# Altium project audio_dev_pcb.PrjPcb (part 3 of 3)

## Sheet audio_io.SchDoc
size A3; SheetNumber: 13; SheetTotal: 13
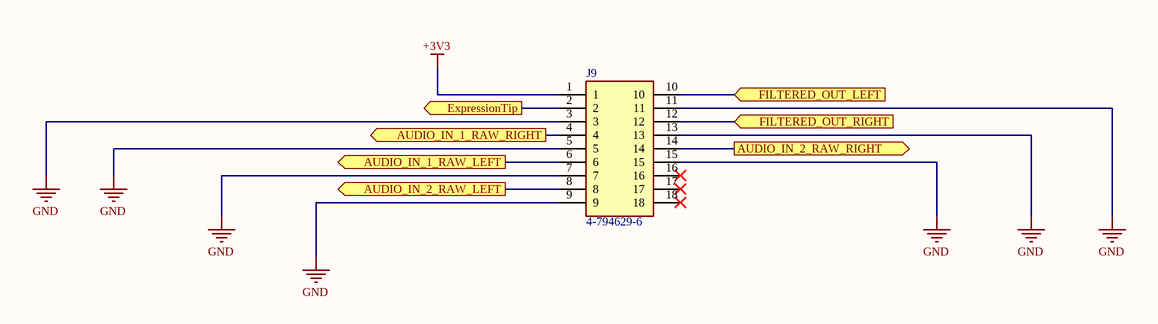
[diagram p11: audio_io.SchDoc]

### Parts
J9  4-794629-6  [47946296]

### Ports
AUDIO_IN_1_RAW_LEFT (out, see high_level[7B], Input_Output_Filtering[3B]), AUDIO_IN_1_RAW_RIGHT (out, see high_level[7B], Input_Output_Filtering[3C]), AUDIO_IN_2_RAW_LEFT (out, see high_level[7C], Input_Output_Filtering[3A]), AUDIO_IN_2_RAW_RIGHT (out, see high_level[7B], Input_Output_Filtering[3B]), ExpressionTip (out, see high_level[7B], Expression_Pedal[3B]), FILTERED_OUT_LEFT (in, see high_level[7C], Input_Output_Filtering[6D]), FILTERED_OUT_RIGHT (in, see high_level[7C], Input_Output_Filtering[6D])

### Nets
+3V3: J9.1
GND: J9.3 J9.5 J9.7 J9.9 J9.11 J9.13 J9.15
AUDIO_IN_1_RAW_LEFT: J9.6 ; port AUDIO_IN_1_RAW_LEFT
AUDIO_IN_1_RAW_RIGHT: J9.4 ; port AUDIO_IN_1_RAW_RIGHT
AUDIO_IN_2_RAW_LEFT: J9.8 ; port AUDIO_IN_2_RAW_LEFT
AUDIO_IN_2_RAW_RIGHT: J9.14 ; port AUDIO_IN_2_RAW_RIGHT
ExpressionTip: J9.2 ; port ExpressionTip
FILTERED_OUT_LEFT: J9.10 ; port FILTERED_OUT_LEFT
FILTERED_OUT_RIGHT: J9.12 ; port FILTERED_OUT_RIGHT

Not connected (* = marked no-connect by the designer): J9 16* 17* 18*

### Library data of the parts
J9 = 4-794629-6: Connector; Manufacturer_Name: TE Connectivity; Datasheet Link: https://www.te.com/commerce/DocumentDelivery/DDEController?Action=srchrtrv&DocNm=micro-mate-n-lok-connector-qrg&DocType=Data%20Sheet&DocLang=English&PartCntxt=4-794629-6&DocFormat=pdf; Height: 8.67mm; Manufacturer_Part_Number: 4-794629-6; Mouser Part Number: 571-4-794629-6; Mouser Price/Stock: https://www.mouser.co.uk/ProductDetail/TE-Connectivity-AMP/4-794629-6?qs=vczR1Rbrl535QN5OwRvF4g%3D%3D; Arrow Part Number: 4-794629-6; Arrow Price/Stock: https://www.arrow.com/en/products/4-794629-6/te-connectivity?region=nac

## Sheet Footswitches.SchDoc
size A3; SheetNumber: 12; SheetTotal: 13
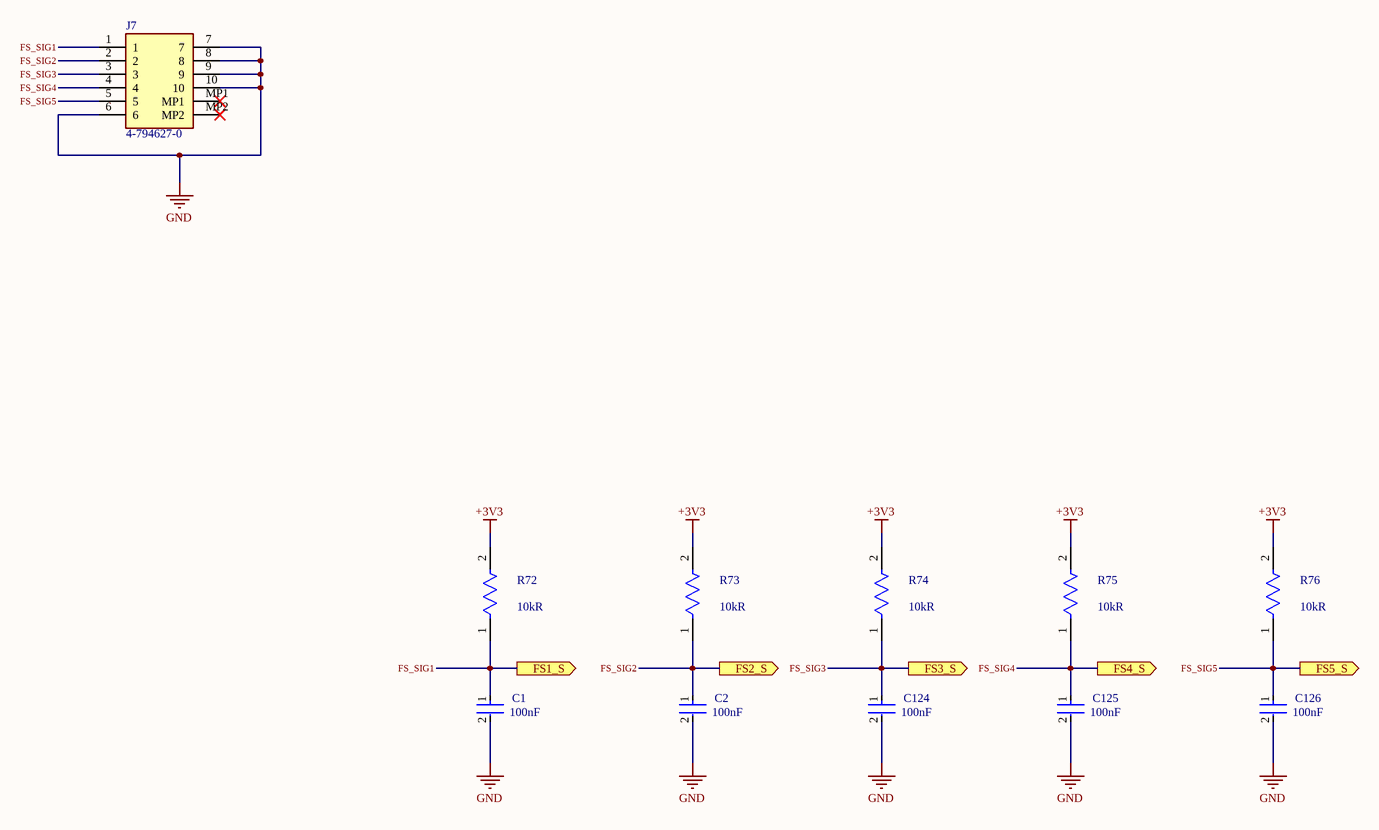
[diagram p12: Footswitches.SchDoc]

### Parts
C1  Capacitance: 100nF  [FP-GCM155-0_05-IPC_A]  (hidden comment: GCM155R71H104ME02J)
C2  Capacitance: 100nF  [FP-GCM155-0_05-IPC_A]  (hidden comment: GCM155R71H104ME02J)
C124  Capacitance: 100nF  [FP-GCM155-0_05-IPC_A]  (hidden comment: GCM155R71H104ME02J)
C125  Capacitance: 100nF  [FP-GCM155-0_05-IPC_A]  (hidden comment: GCM155R71H104ME02J)
C126  Capacitance: 100nF  [FP-GCM155-0_05-IPC_A]  (hidden comment: GCM155R71H104ME02J)
J7  4-794627-0  [47946270]
R72  Resistance: 10kR  [FP-RC0402-0_4-IPC_A]  (hidden comment: RC0402FR-1310KL)
R73  Resistance: 10kR  [FP-RC0402-0_4-IPC_A]  (hidden comment: RC0402FR-1310KL)
R74  Resistance: 10kR  [FP-RC0402-0_4-IPC_A]  (hidden comment: RC0402FR-1310KL)
R75  Resistance: 10kR  [FP-RC0402-0_4-IPC_A]  (hidden comment: RC0402FR-1310KL)
R76  Resistance: 10kR  [FP-RC0402-0_4-IPC_A]  (hidden comment: RC0402FR-1310KL)

### Ports
FS1_S (out, see high_level[3B], MCU_Connections[7C]), FS2_S (out, see high_level[3B], MCU_Connections[7C]), FS3_S (out, see high_level[3B], MCU_Connections[7C]), FS4_S (out, see high_level[3B], MCU_Connections[7C]), FS5_S (out, see high_level[3B], MCU_Connections[7C])

### Nets
+3V3: R72.2 R73.2 R74.2 R75.2 R76.2
GND: C1.2 C2.2 C124.2 C125.2 C126.2 J7.6 J7.7 J7.8 J7.9 J7.10
FS_SIG1: C1.1 J7.1 R72.1 ; port FS1_S
FS_SIG2: C2.1 J7.2 R73.1 ; port FS2_S
FS_SIG3: C124.1 J7.3 R74.1 ; port FS3_S
FS_SIG4: C125.1 J7.4 R75.1 ; port FS4_S
FS_SIG5: C126.1 J7.5 R76.1 ; port FS5_S

Not connected (* = marked no-connect by the designer): J7 MP1* MP2*

### Library data of the parts
C1 C2 C124-C126 = CMP-06035-028957-1: as C108-C123 on sheet Potentiometers
J7 = 4-794627-0: Connector; Manufacturer_Name: TE Connectivity; Datasheet Link: https://www.te.com/commerce/DocumentDelivery/DDEController?Action=srchrtrv&DocNm=micro-mate-n-lok-connector-qrg&DocType=Data%20Sheet&DocLang=English&PartCntxt=4-794627-0&DocFormat=pdf; Height: 8.67mm; Manufacturer_Part_Number: 4-794627-0; Mouser Part Number: 571-4-794627-0; Mouser Price/Stock: https://www.mouser.co.uk/ProductDetail/TE-Connectivity-AMP/4-794627-0?qs=%252BzEhGsOvNvVYq3FriCmQcA%3D%3D; Arrow Part Number: 4-794627-0; Arrow Price/Stock: https://www.arrow.com/en/products/4-794627-0/te-connectivity
R72-R76 = CMP-2002-07854-2: RESISTOR 0402 10K 1%; Power Rating: 62.5mW; Voltage Rating (DC): 50V; Temperature Coefficient: 100ppm/°C; REACH SVHC: No SVHC; Case/Package: 0402; Termination: SMD/SMT; Max Operating Temperature: 155°C; Contact Plating: Tin; Resistance Tolerance: 1%; Radiation Hardening: No; Voltage Rating: 50V; Lead Free: Lead Free; Length: 1mm; Depth: 0.5mm; Number of Pins: 2; RoHS Compliant: Yes; Case Code (Imperial): 0402; Case Code (Metric): 1005; Min Operating Temperature: -55°C; Packaging: Tape and Reel; Technology: THICK FILM; Series: RC; Number of Terminations: 2; Resistor Type: Thick Film; Tolerance: 1%; Working Voltage: 50V; Military Standard: Not; Construction: Rectangular

## Nets that join several sheets
+1V8: Power (C70.2 R49.2 U4.5), USB_HS (C23.2 IC1.21)
+3V3: Memory (28 pins), Power (5 pins), USB_HS (8 pins), Peripherals (13 pins), MCU (34 pins), audio_io (J9.1), Footswitches (5 pins)
+5VA: Expression_Pedal (C106.1 IC12.5), Input_Output_Filtering (13 pins), Power (5 pins), Potentiometers (16 pins)
+VUSB_FILT: Power (D1.2), USB_HS (C78.1 R3.1), Peripherals (C83.2 FB3.2)
GND: Codec (15 pins), Expression_Pedal (C106.2 C107.2 IC12.2 R61.1), Input_Output_Filtering (36 pins), Memory (28 pins), Power (24 pins), USB_HS (9 pins), Peripherals (25 pins), Potentiometers (24 pins), MCU (44 pins), audio_io (7 pins), Footswitches (10 pins)
AUDIO_IN_1_FILTERED_LEFT: Codec (IC3.10), Input_Output_Filtering (C37.2)
AUDIO_IN_1_FILTERED_RIGHT: Codec (IC3.12), Input_Output_Filtering (C42.2)
AUDIO_IN_1_RAW_LEFT: Input_Output_Filtering (R17.1 RV3.2), audio_io (J9.6)
AUDIO_IN_1_RAW_RIGHT: Input_Output_Filtering (R21.1 RV4.2), audio_io (J9.4)
AUDIO_IN_2_FILTERED_LEFT: Codec (IC3.14), Input_Output_Filtering (C60.2)
AUDIO_IN_2_FILTERED_RIGHT: Codec (IC3.16), Input_Output_Filtering (C65.2)
AUDIO_IN_2_RAW_LEFT: Input_Output_Filtering (R39.1 RV1.2), audio_io (J9.8)
AUDIO_IN_2_RAW_RIGHT: Input_Output_Filtering (R43.1 RV2.2), audio_io (J9.14)
CODEC_MCLK: Codec (IC3.1), MCU_Connections (NT11.1)
CODEC_OUT_LEFT: Codec (C55.1), Input_Output_Filtering (C47.1)
CODEC_OUT_RIGHT: Codec (C54.1), Input_Output_Filtering (C51.1)
CODEC_RST: Codec (IC3.31), MCU_Connections (NT23.1)
Expression_Out: Expression_Pedal (R60.2), MCU_Connections (NT14.1)
ExpressionTip: Expression_Pedal (R59.2), audio_io (J9.2)
FILTERED_OUT_LEFT: Input_Output_Filtering (C48.2 R29.2 RV5.2), audio_io (J9.10)
FILTERED_OUT_RIGHT: Input_Output_Filtering (C52.2 R33.2 RV6.2), audio_io (J9.12)
FMC_SDCLK: Memory (IC11.F2), MCU_Connections (R69.1)
FS_SIG1: MCU_Connections (NT61.1), Footswitches (C1.1 J7.1 R72.1)
FS_SIG2: MCU_Connections (NT64.1), Footswitches (C2.1 J7.2 R73.1)
FS_SIG3: MCU_Connections (NT66.1), Footswitches (C124.1 J7.3 R74.1)
FS_SIG4: MCU_Connections (NT67.1), Footswitches (C125.1 J7.4 R75.1)
FS_SIG5: MCU_Connections (NT69.1), Footswitches (C126.1 J7.5 R76.1)
NetIC1_8: USB_HS (IC1.8), MCU_Connections (NT35.1)
NetIC1_9: USB_HS (IC1.9), MCU_Connections (NT32.1)
NetIC1_10: USB_HS (IC1.10), MCU_Connections (NT29.1)
NetIC1_11: USB_HS (IC1.11), MCU_Connections (NT27.1)
NetIC1_12: USB_HS (IC1.12), MCU_Connections (NT37.1)
NetIC1_13: USB_HS (IC1.13), MCU_Connections (NT24.1)
NetIC1_14: USB_HS (IC1.14), MCU_Connections (NT21.1)
NetIC1_15: USB_HS (IC1.15), MCU_Connections (NT18.1)
NetIC1_16: USB_HS (IC1.16), MCU_Connections (NT15.1)
NetIC1_18: USB_HS (IC1.18), MCU_Connections (NT49.1)
NetIC1_19: USB_HS (IC1.19), MCU_Connections (NT42.1)
NetIC1_20: USB_HS (IC1.20), MCU_Connections (NT45.1)
NetIC3_8: Codec (IC3.8 R14.1), MCU_Connections (NT2.1)
NetIC3_9: Codec (IC3.9 R15.1), MCU_Connections (NT5.1)
NetIC10_2: Memory (IC10.2), MCU_Connections (NT4.1)
NetIC21_1: Peripherals (IC21.1), MCU_Connections (NT73.1)
NetIC21_2: Peripherals (IC21.2 IC21.3), MCU_Connections (NT77.1)
NetIC21_4: Peripherals (IC21.4), MCU_Connections (NT75.1)
Pot1_Filtered: Potentiometers (C110.1 R62.2), MCU_Connections (NT39.1)
Pot1_Wiper: Peripherals (J6.2), Potentiometers (IC13.3)
Pot2_Filtered: Potentiometers (C114.1 R64.2), MCU_Connections (NT41.1)
Pot2_Wiper: Peripherals (J6.5), Potentiometers (IC15.3)
Pot3_Filtered: Potentiometers (C118.1 R66.2), MCU_Connections (NT44.1)
Pot3_Wiper: Peripherals (J6.8), Potentiometers (IC17.3)
Pot4_Filtered: Potentiometers (C111.1 R63.2), MCU_Connections (NT48.1)
Pot4_Wiper: Peripherals (J6.11), Potentiometers (IC14.3)
Pot5_Filtered: Potentiometers (C115.1 R65.2), MCU_Connections (NT51.1)
Pot5_Wiper: Peripherals (J6.14), Potentiometers (IC16.3)
Pot6_Filtered: Potentiometers (C119.1 R67.2), MCU_Connections (NT52.1)
Pot6_Wiper: Peripherals (J6.17), Potentiometers (IC18.3)
Pot7_Filtered: Potentiometers (C122.1 R70.2), MCU_Connections (NT53.1)
Pot7_Wiper: Peripherals (J6.20), Potentiometers (IC19.3)
Pot8_Filtered: Potentiometers (C123.1 R71.2), MCU_Connections (NT54.1)
Pot8_Wiper: Peripherals (J6.23), Potentiometers (IC20.3)
QSPI_CLK: Memory (IC10.6), MCU_Connections (R68.1)
QSPI_IO0: Memory (IC10.5), MCU_Connections (NT1.1)
QSPI_IO2: Memory (IC10.3), MCU_Connections (NT7.1)
QSPI_IO3: Memory (IC10.7), MCU_Connections (NT9.1)
RAM_A0: Memory (IC11.H7), MCU_Connections (NT3.1)
RAM_A1: Memory (IC11.H8), MCU_Connections (NT6.1)
RAM_A2: Memory (IC11.J8), MCU_Connections (NT8.1)
RAM_A3: Memory (IC11.J7), MCU_Connections (NT10.1)
RAM_A4: Memory (IC11.J3), MCU_Connections (NT12.1)
RAM_A5: Memory (IC11.J2), MCU_Connections (NT16.1)
RAM_A6: Memory (IC11.H3), MCU_Connections (NT19.1)
RAM_A7: Memory (IC11.H2), MCU_Connections (NT22.1)
RAM_A8: Memory (IC11.H1), MCU_Connections (NT25.1)
RAM_A9: Memory (IC11.G3), MCU_Connections (NT28.1)
RAM_A10: Memory (IC11.H9), MCU_Connections (NT30.1)
RAM_A11: Memory (IC11.G2), MCU_Connections (NT33.1)
RAM_BA0: Memory (IC11.G7), MCU_Connections (NT46.1)
RAM_BA1: Memory (IC11.G8), MCU_Connections (NT50.1)
RAM_CKE: Memory (IC11.F3), MCU_Connections (NT55.1)
RAM_D0: Memory (IC11.A8), MCU_Connections (NT71.1)
RAM_D1: Memory (IC11.B9), MCU_Connections (NT72.1)
RAM_D2: Memory (IC11.B8), MCU_Connections (NT74.1)
RAM_D3: Memory (IC11.C9), MCU_Connections (NT76.1)
RAM_D4: Memory (IC11.C8), MCU_Connections (NT78.1)
RAM_D5: Memory (IC11.D9), MCU_Connections (NT79.1)
RAM_D6: Memory (IC11.D8), MCU_Connections (NT80.1)
RAM_D7: Memory (IC11.E9), MCU_Connections (NT81.1)
RAM_D8: Memory (IC11.E1), MCU_Connections (NT82.1)
RAM_D9: Memory (IC11.D2), MCU_Connections (NT83.1)
RAM_D10: Memory (IC11.D1), MCU_Connections (NT84.1)
RAM_D11: Memory (IC11.C2), MCU_Connections (NT85.1)
RAM_D12: Memory (IC11.C1), MCU_Connections (NT86.1)
RAM_D13: Memory (IC11.B2), MCU_Connections (NT87.1)
RAM_D14: Memory (IC11.B1), MCU_Connections (NT88.1)
RAM_D15: Memory (IC11.A2), MCU_Connections (NT89.1)
RAM_DMH: Memory (IC11.F1), MCU_Connections (NT91.1)
RAM_DML: Memory (IC11.E8), MCU_Connections (NT90.1)
RAM_NCAS: Memory (IC11.F7), MCU_Connections (NT65.1)
RAM_NCS: Memory (IC11.G9), MCU_Connections (NT58.1)
RAM_NRAS: Memory (IC11.F8), MCU_Connections (NT62.1)
RAM_NWE: Memory (IC11.F9), MCU_Connections (NT68.1)
SAI1_FS_A: Codec (IC3.3), MCU_Connections (NT26.1)
SAI1_SCK_A: Codec (IC3.2), MCU_Connections (NT13.1)
SAI1_SD_A: Codec (IC3.4), MCU_Connections (NT17.1)
SAI1_SD_B: Codec (IC3.5), MCU_Connections (NT20.1)
SD_CLK: Memory (J4.5), MCU_Connections (NT38.1)
SD_CMD: Memory (J4.3 R55.1), MCU_Connections (NT36.1)
SD_D0: Memory (J4.7 R56.1), MCU_Connections (NT43.1)
SD_D1: Memory (J4.8 R57.1), MCU_Connections (NT47.1)
SD_D2: Memory (J4.1 R47.1), MCU_Connections (NT31.1)
SD_D3: Memory (J4.2 R54.1), MCU_Connections (NT34.1)
SD_DET: Memory (J4.CD1 R58.1), MCU_Connections (NT40.1)
SPI3_MISO: Peripherals (J2.2), MCU_Connections (NT57.1)
SPI3_MOSI: Peripherals (J2.3), MCU_Connections (NT59.1)
SPI3_SCK: Peripherals (J2.1), MCU_Connections (NT56.1)
USB_FS_D_N: Peripherals (IC2.6), MCU_Connections (NT63.1)
USB_FS_D_P: Peripherals (IC2.7), MCU_Connections (NT60.1)
USB_HS_D_N: USB_HS (IC1.5), Peripherals (IC2.4)
USB_HS_D_P: USB_HS (IC1.6), Peripherals (IC2.5)
USB_SW: Peripherals (IC2.10 R9.2), MCU_Connections (NT70.1)